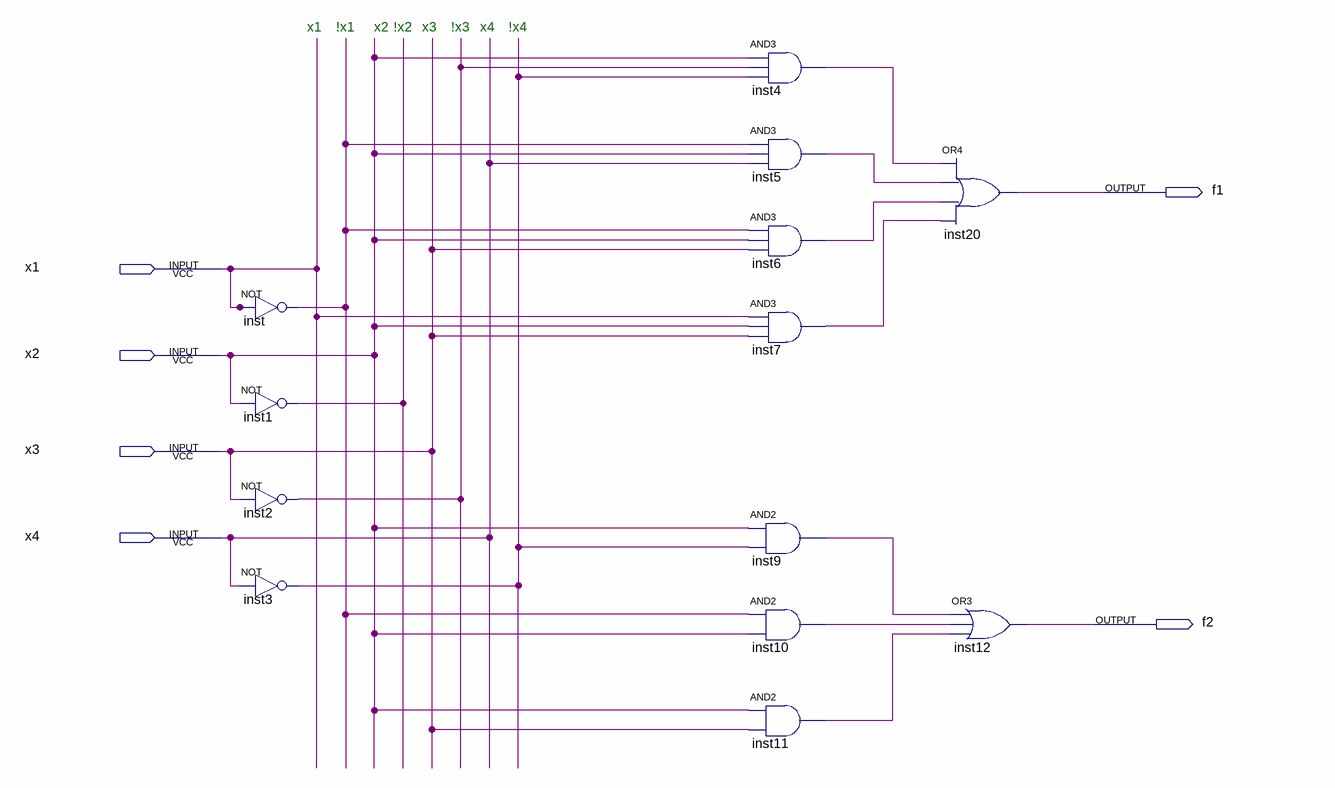
[diagram p0: schematic sheet]
// Quartus schematic Problem4.bdf as structural Verilog: 13 symbols, 6 pins
module Problem4 (
  input  x1,
  input  x2,
  input  x3,
  input  x4,
  output f1,
  output f2
);

  wire inst1_out, inst2_out, inst3_out, inst4_out, inst5_out, inst6_out, inst7_out, inst9_out, inst10_out,
       inst11_out, inst_out;

  not inst (inst_out, x1);
  not inst1 (inst1_out, x2);
  not inst2 (inst2_out, x3);
  not inst3 (inst3_out, x4);
  and inst4 (inst4_out, x2, inst2_out, inst3_out);
  and inst5 (inst5_out, inst_out, x2, x4);
  and inst6 (inst6_out, inst_out, x2, x3);
  and inst7 (inst7_out, x1, x2, x3);
  and inst9 (inst9_out, x2, inst3_out);
  and inst10 (inst10_out, inst_out, x2);
  and inst11 (inst11_out, x2, x3);
  or inst20 (f1, inst4_out, inst5_out, inst6_out, inst7_out);
  or inst12 (f2, inst9_out, inst10_out, inst11_out);

  // Notes on the sheet:
  //   x1
  //   !x1
  //   x2
  //   !x2
  //   x3
  //   !x3
  //   x4
  //   !x4
endmodule
